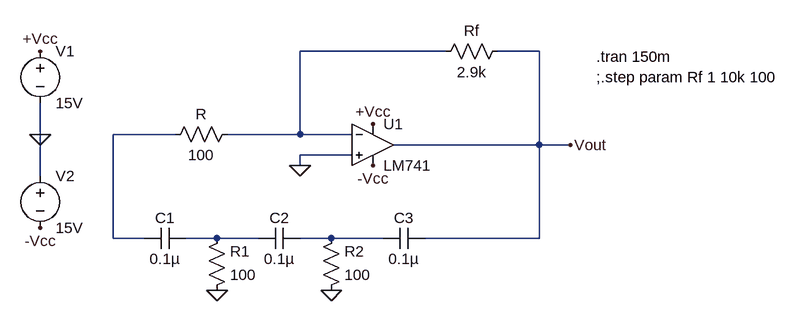
[diagram p0: schematic RC Phase Shift.asc]
RC Phase Shift.asc, the LTspice schematic file:
Version 4
SHEET 1 880 680
WIRE 288 16 64 16
WIRE 432 16 368 16
WIRE -336 144 -336 96
WIRE -128 144 -224 144
WIRE 64 144 64 16
WIRE 64 144 -48 144
WIRE 144 144 64 144
WIRE 432 160 432 16
WIRE 432 160 208 160
WIRE 480 160 432 160
WIRE 144 176 64 176
WIRE 64 192 64 176
WIRE -336 208 -336 144
WIRE -224 304 -224 144
WIRE -176 304 -224 304
WIRE -64 304 -112 304
WIRE 0 304 -64 304
WIRE 112 304 64 304
WIRE 192 304 112 304
WIRE 432 304 432 160
WIRE 432 304 256 304
FLAG -336 144 0
FLAG -64 384 0
FLAG 112 384 0
FLAG 64 192 0
FLAG 480 160 Vout
FLAG -336 16 +Vcc
FLAG 176 128 +Vcc
FLAG -336 288 -Vcc
FLAG 176 192 -Vcc
SYMBOL Opamps\\LM741 176 96 R0
SYMATTR InstName U1
SYMBOL res -32 128 R90
WINDOW 0 0 56 VBottom 2
WINDOW 3 32 56 VTop 2
SYMATTR InstName R
SYMATTR Value 100
SYMBOL res 384 0 R90
WINDOW 0 0 56 VBottom 2
WINDOW 3 32 56 VTop 2
SYMATTR InstName Rf
SYMATTR Value 2.9k
SYMBOL res -80 400 M180
WINDOW 0 36 76 Left 2
WINDOW 3 36 40 Left 2
SYMATTR InstName R1
SYMATTR Value 100
SYMBOL res 96 400 M180
WINDOW 0 36 76 Left 2
WINDOW 3 36 40 Left 2
SYMATTR InstName R2
SYMATTR Value 100
SYMBOL cap -112 288 R90
WINDOW 0 0 32 VBottom 2
WINDOW 3 32 32 VTop 2
SYMATTR InstName C1
SYMATTR Value 0.1µ
SYMBOL cap 64 288 R90
WINDOW 0 0 32 VBottom 2
WINDOW 3 32 32 VTop 2
SYMATTR InstName C2
SYMATTR Value 0.1µ
SYMBOL cap 256 288 R90
WINDOW 0 0 32 VBottom 2
WINDOW 3 32 32 VTop 2
SYMATTR InstName C3
SYMATTR Value 0.1µ
SYMBOL voltage -336 0 R0
SYMATTR InstName V1
SYMATTR Value 15V
SYMBOL voltage -336 192 R0
SYMATTR InstName V2
SYMATTR Value 15V
TEXT 520 56 Left 2 !;.step param Rf 1 10k 100
TEXT 520 24 Left 2 !.tran 150m

The netlist it stands for:
* RC Phase Shift.asc
XU1 0 N001 +Vcc -Vcc Vout LM741  ; pins In+ In- V+ V- OUT
R N001 N002 100
Rf Vout N001 2.9k
R1 0 N003 100
R2 0 N004 100
C1 N003 N002 0.1µ
C2 N004 N003 0.1µ
C3 Vout N004 0.1µ
V1 +Vcc 0 15V
V2 0 -Vcc 15V
;.step param Rf 1 10k 100
.tran 150m
.lib LM741.lib
.backanno
.end